# Altium schematic sheet obc_main.SchDoc: OBC Main
size A; DrawnBy: Mohamed Hirole; Organization: UTAT SS; DocumentNumber: 1; Revision: 1.0; SheetNumber: 1; SheetTotal: 8
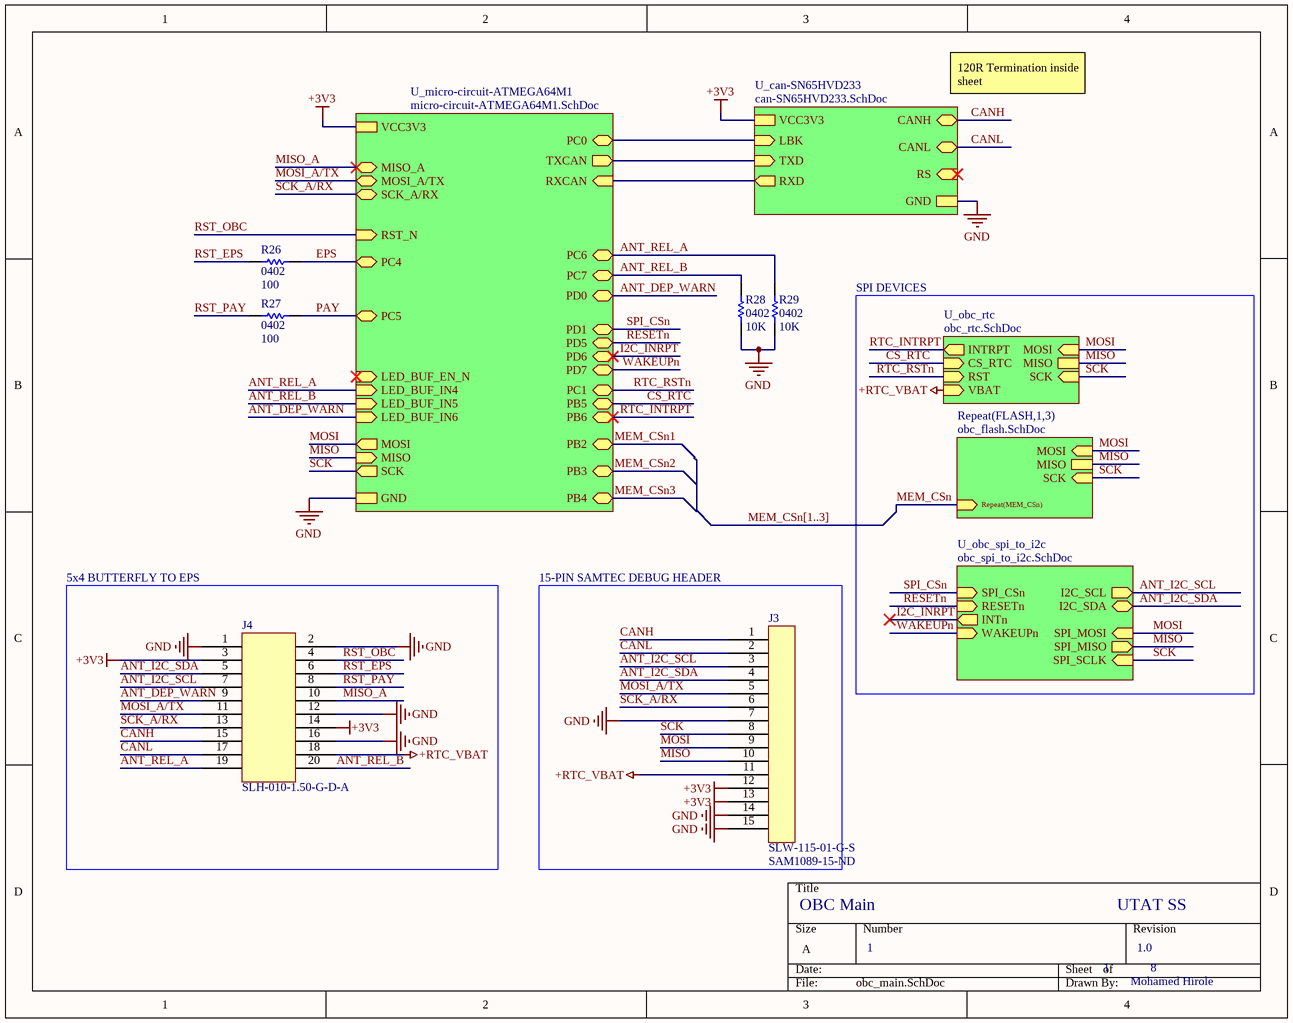
[diagram p0: obc_main.SchDoc]

## Parts
J3  SLW-115-01-G-S  [SAM1089-15-ND]
J4  SLH-010-1.50-G-D-A  [SLH-010-1.50-G-D-A]
R26  0402  value 100  [RES0402R]
R27  0402  value 100  [RES0402R]
R28  0402  value 10K  [RES0402R]
R29  0402  value 10K  [RES0402R]

## Blocks framed on the sheet
5x4 BUTTERFLY TO EPS: J4
15-PIN SAMTEC DEBUG HEADER: J3

## Sub-sheets
Repeat(FLASH,1,3) = obc_flash.SchDoc: MOSI (in), SCK (in), MISO, Repeat(MEM_CSn) (in)
U_can-SN65HVD233 = can-SN65HVD233.SchDoc: RXD (out), TXD (in), LBK (in), CANL (bidir), CANH (bidir), VCC3V3, GND, RS (in)
U_micro-circuit-ATMEGA64M1 = micro-circuit-ATMEGA64M1.SchDoc: MISO (in), MOSI (out), SCK (out), TXCAN (out), RXCAN (in), MISO_A (bidir), MOSI_A/TX (bidir), SCK_A/RX (bidir), PB2 (bidir), PB3 (bidir), PB4 (bidir), PB5 (bidir), PB6 (bidir), PC0 (bidir), PD0 (bidir), PC1 (bidir), PC4 (bidir), PC5 (bidir), PC6 (bidir), PC7 (bidir), PD1 (bidir), PD5 (bidir), PD6 (bidir), PD7 (bidir), RST_N (in), LED_BUF_EN_N (in), VCC3V3, GND, LED_BUF_IN4 (in), LED_BUF_IN5 (in), LED_BUF_IN6 (in)
U_obc_rtc = obc_rtc.SchDoc: CS_RTC (in), MOSI (in), MISO, SCK (in), INTRPT (out), VBAT (in), RST (in)
U_obc_spi_to_i2c = obc_spi_to_i2c.SchDoc: SPI_MOSI (in), I2C_SDA (bidir), INTn (out), WAKEUPn (in), RESETn (in), SPI_MISO (out), SPI_CSn (in), SPI_SCLK (in), I2C_SCL (out)

## Nets
+3V3: J3.12 J3.13 J4.3 J4.14 ; sheet U_micro-circuit-ATMEGA64M1/VCC3V3, sheet U_can-SN65HVD233/VCC3V3
+RTC_VBAT: J3.11 J4.18 ; sheet U_obc_rtc/VBAT
GND: J3.7 J3.14 J3.15 J4.1 J4.2 J4.12 J4.16 R28.1 R29.1 ; sheet U_micro-circuit-ATMEGA64M1/GND, sheet U_can-SN65HVD233/GND
ANT_DEP_WARN: J4.9 ; sheet U_micro-circuit-ATMEGA64M1/PD0, sheet U_micro-circuit-ATMEGA64M1/LED_BUF_IN6
ANT_I2C_SCL: J3.3 J4.7 ; sheet U_obc_spi_to_i2c/I2C_SCL
ANT_I2C_SDA: J3.4 J4.5 ; sheet U_obc_spi_to_i2c/I2C_SDA
ANT_REL_A: J4.19 R29.2 ; sheet U_micro-circuit-ATMEGA64M1/PC6, sheet U_micro-circuit-ATMEGA64M1/LED_BUF_IN4
ANT_REL_B: J4.20 R28.2 ; sheet U_micro-circuit-ATMEGA64M1/PC7, sheet U_micro-circuit-ATMEGA64M1/LED_BUF_IN5
CANH: J3.1 J4.15 ; sheet U_can-SN65HVD233/CANH
CANL: J3.2 J4.17 ; sheet U_can-SN65HVD233/CANL
CS_RTC: sheet U_obc_rtc/CS_RTC, sheet U_micro-circuit-ATMEGA64M1/PB5
EPS: R26.2 ; sheet U_micro-circuit-ATMEGA64M1/PC4
I2C_INRPT: sheet U_micro-circuit-ATMEGA64M1/PD6, sheet U_obc_spi_to_i2c/INTn
MEM_CSn: sheet Repeat(FLASH,1,3)/Repeat(MEM_CSn)
MEM_CSn1: sheet U_micro-circuit-ATMEGA64M1/PB2
MEM_CSn2: sheet U_micro-circuit-ATMEGA64M1/PB3
MEM_CSn3: sheet U_micro-circuit-ATMEGA64M1/PB4
MISO: J3.10 ; sheet U_obc_rtc/MISO, sheet Repeat(FLASH,1,3)/MISO, sheet U_micro-circuit-ATMEGA64M1/MISO, sheet U_obc_spi_to_i2c/SPI_MISO
MISO_A: J4.10 ; sheet U_micro-circuit-ATMEGA64M1/MISO_A
MOSI: J3.9 ; sheet U_obc_rtc/MOSI, sheet Repeat(FLASH,1,3)/MOSI, sheet U_micro-circuit-ATMEGA64M1/MOSI, sheet U_obc_spi_to_i2c/SPI_MOSI
MOSI_A/TX: J3.5 J4.11 ; sheet U_micro-circuit-ATMEGA64M1/MOSI_A/TX
PAY: R27.2 ; sheet U_micro-circuit-ATMEGA64M1/PC5
RESETn: sheet U_micro-circuit-ATMEGA64M1/PD5, sheet U_obc_spi_to_i2c/RESETn
RST_EPS: J4.6 R26.1
RST_OBC: J4.4 ; sheet U_micro-circuit-ATMEGA64M1/RST_N
RST_PAY: J4.8 R27.1
RTC_INTRPT: sheet U_obc_rtc/INTRPT, sheet U_micro-circuit-ATMEGA64M1/PB6
RTC_RSTn: sheet U_obc_rtc/RST, sheet U_micro-circuit-ATMEGA64M1/PC1
SCK: J3.8 ; sheet U_obc_rtc/SCK, sheet Repeat(FLASH,1,3)/SCK, sheet U_micro-circuit-ATMEGA64M1/SCK, sheet U_obc_spi_to_i2c/SPI_SCLK
SCK_A/RX: J3.6 J4.13 ; sheet U_micro-circuit-ATMEGA64M1/SCK_A/RX
SPI_CSn: sheet U_micro-circuit-ATMEGA64M1/PD1, sheet U_obc_spi_to_i2c/SPI_CSn
WAKEUPn: sheet U_micro-circuit-ATMEGA64M1/PD7, sheet U_obc_spi_to_i2c/WAKEUPn
(unnamed): sheet U_micro-circuit-ATMEGA64M1/TXCAN, sheet U_can-SN65HVD233/TXD
(unnamed): sheet U_micro-circuit-ATMEGA64M1/RXCAN, sheet U_can-SN65HVD233/RXD
(unnamed): sheet U_micro-circuit-ATMEGA64M1/PC0, sheet U_can-SN65HVD233/LBK

## Buses and harness runs
bus MEM_CSn[1..3]

## Notes on the sheet
- 120R Termination inside sheet
- SPI DEVICES

## Library data of the parts
J3 = SLW-115-01-G-S: 15 Position Receptacle Connector 0.100" (2.54mm) Through Hole Gold; Manufacturer: Samtec; Max Current Rating: 7.1A; Contact Resistance: 10mR; Number of Positions: 15; Max Voltage Rating (AC): 550V; Gender: Female; Supplier 1: Digi-Key; Manufacturer Part Number: SLW-115-01-G-S; Stock 1: 0; Pricing 1: 1=2.44, 10=2.214, 25=2.0784, 50=1.988, 100=1.8976, 250=1.71684, 500=1.5813 (USD); Mount: Through Hole; Contact Plating: Gold; Contact Material: Bronze; Color: Black; Housing Color: Black; Housing Material: Polyester; Min Operating Temperature: -55°C; Max Operating Temperature: 125°C; Number of Rows: 1; Packaging: Bulk; Connector Type: Receptacle; Termination: Solder; Number of Contacts: 15; Orientation: Straight; Voltage Rating (AC): 550V; Package Quantity: 1; Length: 38.1mm; Pitch: 2.54mm; Depth: 2.54mm; Width: 2.54mm; Radiation Hardening: No; Lead Free: Lead Free; ComponentLink1URL: http://suddendocs.samtec.com/prints/slw-1xx-01-x-x-mkt.pdf?src-supplier=Digi-Key; ComponentLink1Description: http://suddendocs.samtec.com/prints/slw-1xx-01-x-x-mkt.pdf?src-supplier=Digi-Key; Supplier Part Number 1: SAM1089-15-ND
J4 = SLH-010-1.50-G-D-A: 0.50 mm Razor Beam™ LP Ultra Low Profile Socket Strip, alignment pin option; Supplier 1: SLH-010-1.50-G-D-A; Supplier Part Number 1: Samtec; ComponentLink1Description: Product Page; ComponentLink1URL: https://www.samtec.com/products/slh-010-1.50-g-d-a
R26-R29 = RES0402: 0402 resistor